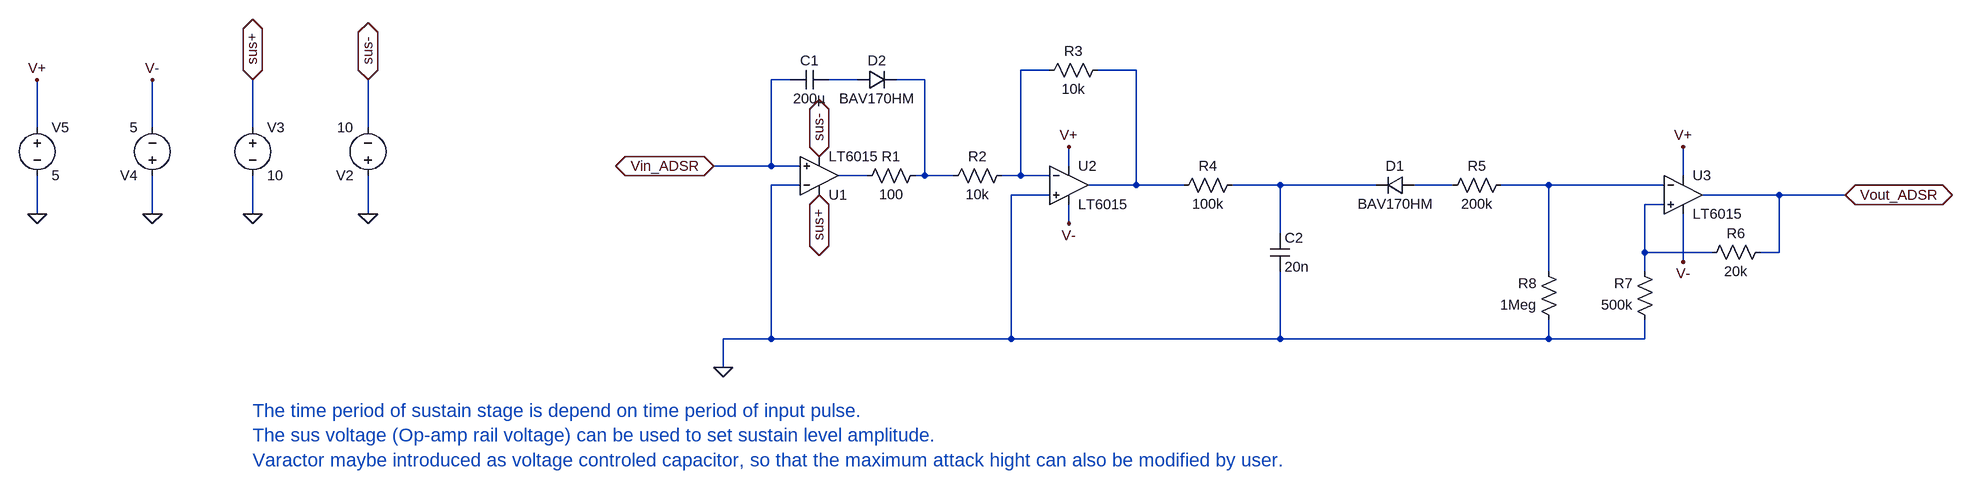
[diagram p0: schematic ADSR_improved.asc]
ADSR_improved.asc, the LTspice schematic file:
Version 4
SHEET 1 2628 1844
WIRE 656 -480 608 -480
WIRE 800 -480 736 -480
WIRE 224 -464 192 -464
WIRE 336 -464 288 -464
WIRE 448 -464 400 -464
WIRE -1088 -384 -1088 -464
WIRE -896 -384 -896 -464
WIRE -672 -384 -672 -464
WIRE -480 -384 -480 -464
WIRE 192 -320 192 -464
WIRE 192 -320 96 -320
WIRE 240 -320 192 -320
WIRE 688 -320 688 -352
WIRE 352 -304 304 -304
WIRE 448 -304 448 -464
WIRE 448 -304 432 -304
WIRE 496 -304 448 -304
WIRE 608 -304 608 -480
WIRE 608 -304 576 -304
WIRE 656 -304 608 -304
WIRE 1712 -304 1712 -352
WIRE 240 -288 192 -288
WIRE 800 -288 800 -480
WIRE 800 -288 720 -288
WIRE 880 -288 800 -288
WIRE 1040 -288 960 -288
WIRE 1200 -288 1040 -288
WIRE 1328 -288 1264 -288
WIRE 1488 -288 1408 -288
WIRE 1680 -288 1488 -288
WIRE 656 -272 592 -272
WIRE 1872 -272 1744 -272
WIRE 1984 -272 1872 -272
WIRE 1680 -256 1648 -256
WIRE -1088 -240 -1088 -304
WIRE -896 -240 -896 -304
WIRE -672 -240 -672 -304
WIRE -480 -240 -480 -304
WIRE 688 -224 688 -256
WIRE 1040 -208 1040 -288
WIRE 1648 -176 1648 -256
WIRE 1760 -176 1648 -176
WIRE 1872 -176 1872 -272
WIRE 1872 -176 1840 -176
WIRE 1712 -160 1712 -240
WIRE 1488 -144 1488 -288
WIRE 1648 -144 1648 -176
WIRE 192 -32 192 -288
WIRE 192 -32 112 -32
WIRE 592 -32 592 -272
WIRE 592 -32 192 -32
WIRE 1040 -32 1040 -144
WIRE 1040 -32 592 -32
WIRE 1488 -32 1488 -64
WIRE 1488 -32 1040 -32
WIRE 1648 -32 1648 -64
WIRE 1648 -32 1488 -32
WIRE 112 16 112 -32
FLAG 272 -272 sus+
IOPIN 272 -272 BiDir
FLAG 272 -336 sus-
IOPIN 272 -336 BiDir
FLAG 688 -352 V+
FLAG 688 -224 V-
FLAG 1984 -272 Vout_ADSR
IOPIN 1984 -272 BiDir
FLAG 96 -320 Vin_ADSR
IOPIN 96 -320 BiDir
FLAG -672 -240 0
FLAG -672 -464 sus+
IOPIN -672 -464 BiDir
FLAG -480 -464 sus-
IOPIN -480 -464 BiDir
FLAG -480 -240 0
FLAG 112 16 0
FLAG -1088 -240 0
FLAG -1088 -464 V+
FLAG -896 -464 V-
FLAG -896 -240 0
FLAG 1712 -160 V-
FLAG 1712 -352 V+
SYMBOL Opamps\\LT6015 272 -304 M180
SYMATTR InstName U1
SYMBOL cap 288 -480 R90
WINDOW 0 0 32 VBottom 2
WINDOW 3 32 32 VTop 2
SYMATTR InstName C1
SYMATTR Value 200µ
SYMATTR SpiceLine V=4 Irms=3.38 Rser=0.0190129 Lser=0
SYMBOL Opamps\\LT6015 688 -288 R0
SYMATTR InstName U2
SYMBOL res 592 -320 R90
WINDOW 0 0 56 VBottom 2
WINDOW 3 32 56 VTop 2
SYMATTR InstName R2
SYMATTR Value 10k
SYMBOL res 752 -496 R90
WINDOW 0 0 56 VBottom 2
WINDOW 3 32 56 VTop 2
SYMATTR InstName R3
SYMATTR Value 10k
SYMBOL voltage -480 -288 R180
WINDOW 123 0 0 Left 0
WINDOW 39 0 0 Left 0
SYMATTR InstName V2
SYMATTR Value 10
SYMBOL voltage -672 -400 R0
WINDOW 123 0 0 Left 0
WINDOW 39 0 0 Left 0
SYMATTR InstName V3
SYMATTR Value 10
SYMBOL voltage -896 -288 R180
WINDOW 123 0 0 Left 0
WINDOW 39 0 0 Left 0
SYMATTR InstName V4
SYMATTR Value 5
SYMBOL voltage -1088 -400 R0
WINDOW 123 0 0 Left 0
WINDOW 39 0 0 Left 0
SYMATTR InstName V5
SYMATTR Value 5
SYMBOL diode 336 -448 R270
WINDOW 0 32 32 VTop 2
WINDOW 3 0 32 VBottom 2
SYMATTR InstName D2
SYMATTR Value BAV170HM
SYMBOL res 448 -320 R90
WINDOW 0 0 56 VBottom 2
WINDOW 3 32 56 VTop 2
SYMATTR InstName R1
SYMATTR Value 100
SYMBOL res 976 -304 R90
WINDOW 0 0 56 VBottom 2
WINDOW 3 32 56 VTop 2
SYMATTR InstName R4
SYMATTR Value 100k
SYMBOL cap 1024 -208 R0
SYMATTR InstName C2
SYMATTR Value 20n
SYMBOL diode 1264 -304 R90
WINDOW 0 0 32 VBottom 2
WINDOW 3 32 32 VTop 2
SYMATTR InstName D1
SYMATTR Value BAV170HM
SYMBOL res 1424 -304 R90
WINDOW 0 0 56 VBottom 2
WINDOW 3 32 56 VTop 2
SYMATTR InstName R5
SYMATTR Value 200k
SYMBOL Opamps\\LT6015 1712 -272 R0
SYMATTR InstName U3
SYMBOL res 1856 -192 R90
WINDOW 0 0 56 VBottom 2
WINDOW 3 32 56 VTop 2
SYMATTR InstName R6
SYMATTR Value 20k
SYMBOL res 1664 -48 R180
WINDOW 0 36 76 Left 2
WINDOW 3 36 40 Left 2
SYMATTR InstName R7
SYMATTR Value 500k
SYMBOL res 1504 -48 R180
WINDOW 0 36 76 Left 2
WINDOW 3 36 40 Left 2
SYMATTR InstName R8
SYMATTR Value 1Meg
TEXT -672 88 Left 3 ;The time period of sustain stage is depend on time period of input pulse.\nThe sus voltage (Op-amp rail voltage) can be used to set sustain level amplitude.\nVaractor maybe introduced as voltage controled capacitor, so that the maximum attack hight can also be modified by user.

The netlist it stands for:
* ADSR_improved.asc
XU1 Vin_ADSR 0 sus+ sus- N005 LT6016  ; LT6015, pins In+ In- V+ V- OUT
C1 N003 Vin_ADSR 200µ V=4 Irms=3.38 Rser=0.0190129 Lser=0
XU2 0 N001 V+ V- N002 LT6016  ; LT6015, pins In+ In- V+ V- OUT
R2 N001 N004 10k
R3 N002 N001 10k
V2 0 sus- 10
V3 sus+ 0 10
V4 0 V- 5
V5 V+ 0 5
D2 N003 N004 BAV170HM
R1 N004 N005 100
R4 N006 N002 100k
C2 N006 0 20n
D1 N007 N006 BAV170HM
R5 N008 N007 200k
XU3 N009 N008 V+ V- Vout_ADSR LT6016  ; LT6015, pins In+ In- V+ V- OUT
R6 Vout_ADSR N009 20k
R7 0 N009 500k
R8 0 N008 1Meg
.model D D
.lib standard.dio
* The time period of sustain stage is depend on time period of input pulse.
* The sus voltage (Op-amp rail voltage) can be used to set sustain level amplitude.
* Varactor maybe introduced as voltage controled capacitor, so that the maximum attack hight can also be modified by user.
.lib LTC2.lib
.backanno
.end